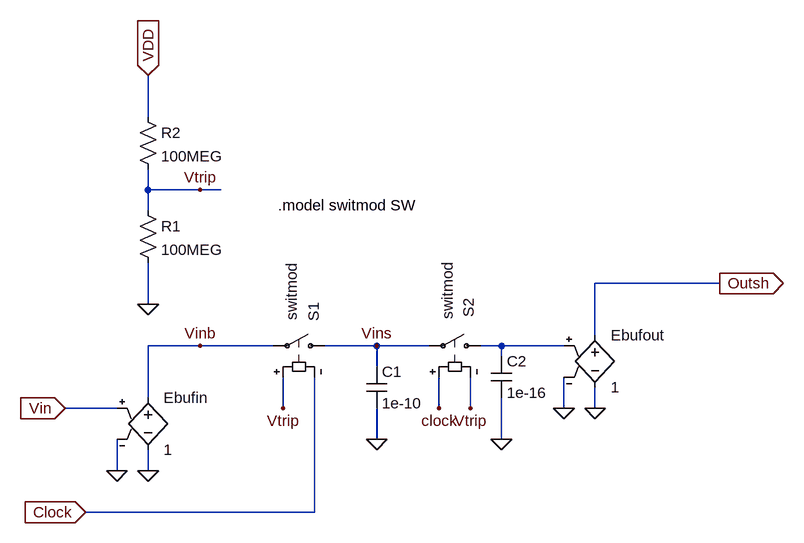
[diagram p0: schematic Sample_and_hold.asc]
Sample_and_hold.asc, the LTspice schematic file:
Version 4
SHEET 1 2740 696
WIRE 112 -384 112 -448
WIRE 112 -272 112 -304
WIRE 192 -272 112 -272
WIRE 224 -272 192 -272
WIRE 112 -240 112 -272
WIRE 992 -128 800 -128
WIRE 112 -96 112 -160
WIRE 800 -48 800 -128
WIRE 192 -32 112 -32
WIRE 304 -32 192 -32
WIRE 464 -32 384 -32
WIRE 544 -32 464 -32
WIRE 656 -32 624 -32
WIRE 752 -32 656 -32
WIRE 656 -16 656 -32
WIRE 464 0 464 -32
WIRE 112 48 112 -32
WIRE 64 64 -16 64
WIRE 320 64 320 16
WIRE 560 64 560 16
WIRE 608 64 608 16
WIRE 752 64 752 16
WIRE 800 64 800 32
WIRE 464 112 464 64
WIRE 656 112 656 48
WIRE 64 160 64 112
WIRE 112 160 112 128
WIRE 368 224 368 16
WIRE 368 224 16 224
FLAG 112 160 0
FLAG 192 -32 Vinb
FLAG 464 -32 Vins
FLAG 320 64 Vtrip
FLAG 16 224 Clock
IOPIN 16 224 In
FLAG 800 64 0
FLAG 464 112 0
FLAG 560 64 clock
FLAG 608 64 Vtrip
FLAG 656 112 0
FLAG -16 64 Vin
IOPIN -16 64 In
FLAG 192 -272 Vtrip
FLAG 112 -448 VDD
IOPIN 112 -448 In
FLAG 112 -96 0
FLAG 992 -128 Outsh
IOPIN 992 -128 Out
FLAG 752 64 0
FLAG 64 160 0
SYMBOL sw 400 -32 M270
WINDOW 3 24 -12 Left 0
WINDOW 38 39 67 Left 0
WINDOW 0 38 33 Left 0
SYMATTR Value ""
SYMATTR SpiceModel switmod
SYMATTR InstName S1
SYMBOL cap 448 0 R0
SYMATTR InstName C1
SYMATTR Value 1e-10
SYMBOL sw 640 -32 M270
WINDOW 3 24 -12 Left 0
WINDOW 38 41 67 Left 0
WINDOW 0 44 35 Left 0
SYMATTR Value ""
SYMATTR SpiceModel switmod
SYMATTR InstName S2
SYMBOL cap 640 -16 R0
SYMATTR InstName C2
SYMATTR Value 1e-16
SYMBOL res 96 -256 R0
SYMATTR InstName R1
SYMATTR Value 100MEG
SYMBOL res 96 -400 R0
SYMATTR InstName R2
SYMATTR Value 100MEG
SYMBOL e 800 -64 R0
SYMATTR InstName Ebufout
SYMATTR Value 1
SYMBOL e 112 32 R0
SYMATTR InstName Ebufin
SYMATTR Value 1
TEXT 312 -248 Left 0 !.model switmod SW

The netlist it stands for:
* Sample_and_hold.asc
S1 Vins Vinb Vtrip Clock switmod
C1 Vins 0 1e-10
S2 N001 Vins Clock Vtrip switmod
C2 N001 0 1e-16
R1 Vtrip 0 100MEG
R2 VDD Vtrip 100MEG
Ebufout Outsh 0 N001 0 1
Ebufin Vinb 0 Vin 0 1
.model switmod SW
.backanno
.end